# Altium schematic sheet WS485H-V3.SchDoc: WS485H-V1
size A2; Author: Fred; PageSetup: Record=PageOptions|CenterHorizontal=True|CenterVertical=True|PrintScale=1.04|XCorrection=1.00|YCorrection=1.00|PrintKind=0|BorderSize=5000000|LeftOffset=0|BottomOffset=0|Orientation=1|PaperLength=1000|PaperWidth=1000|Scale=100|PaperSource=7|PrintQuality=-4|MediaType=1|DitherType=10|PaperKind=A3|PrintScaleMode=1
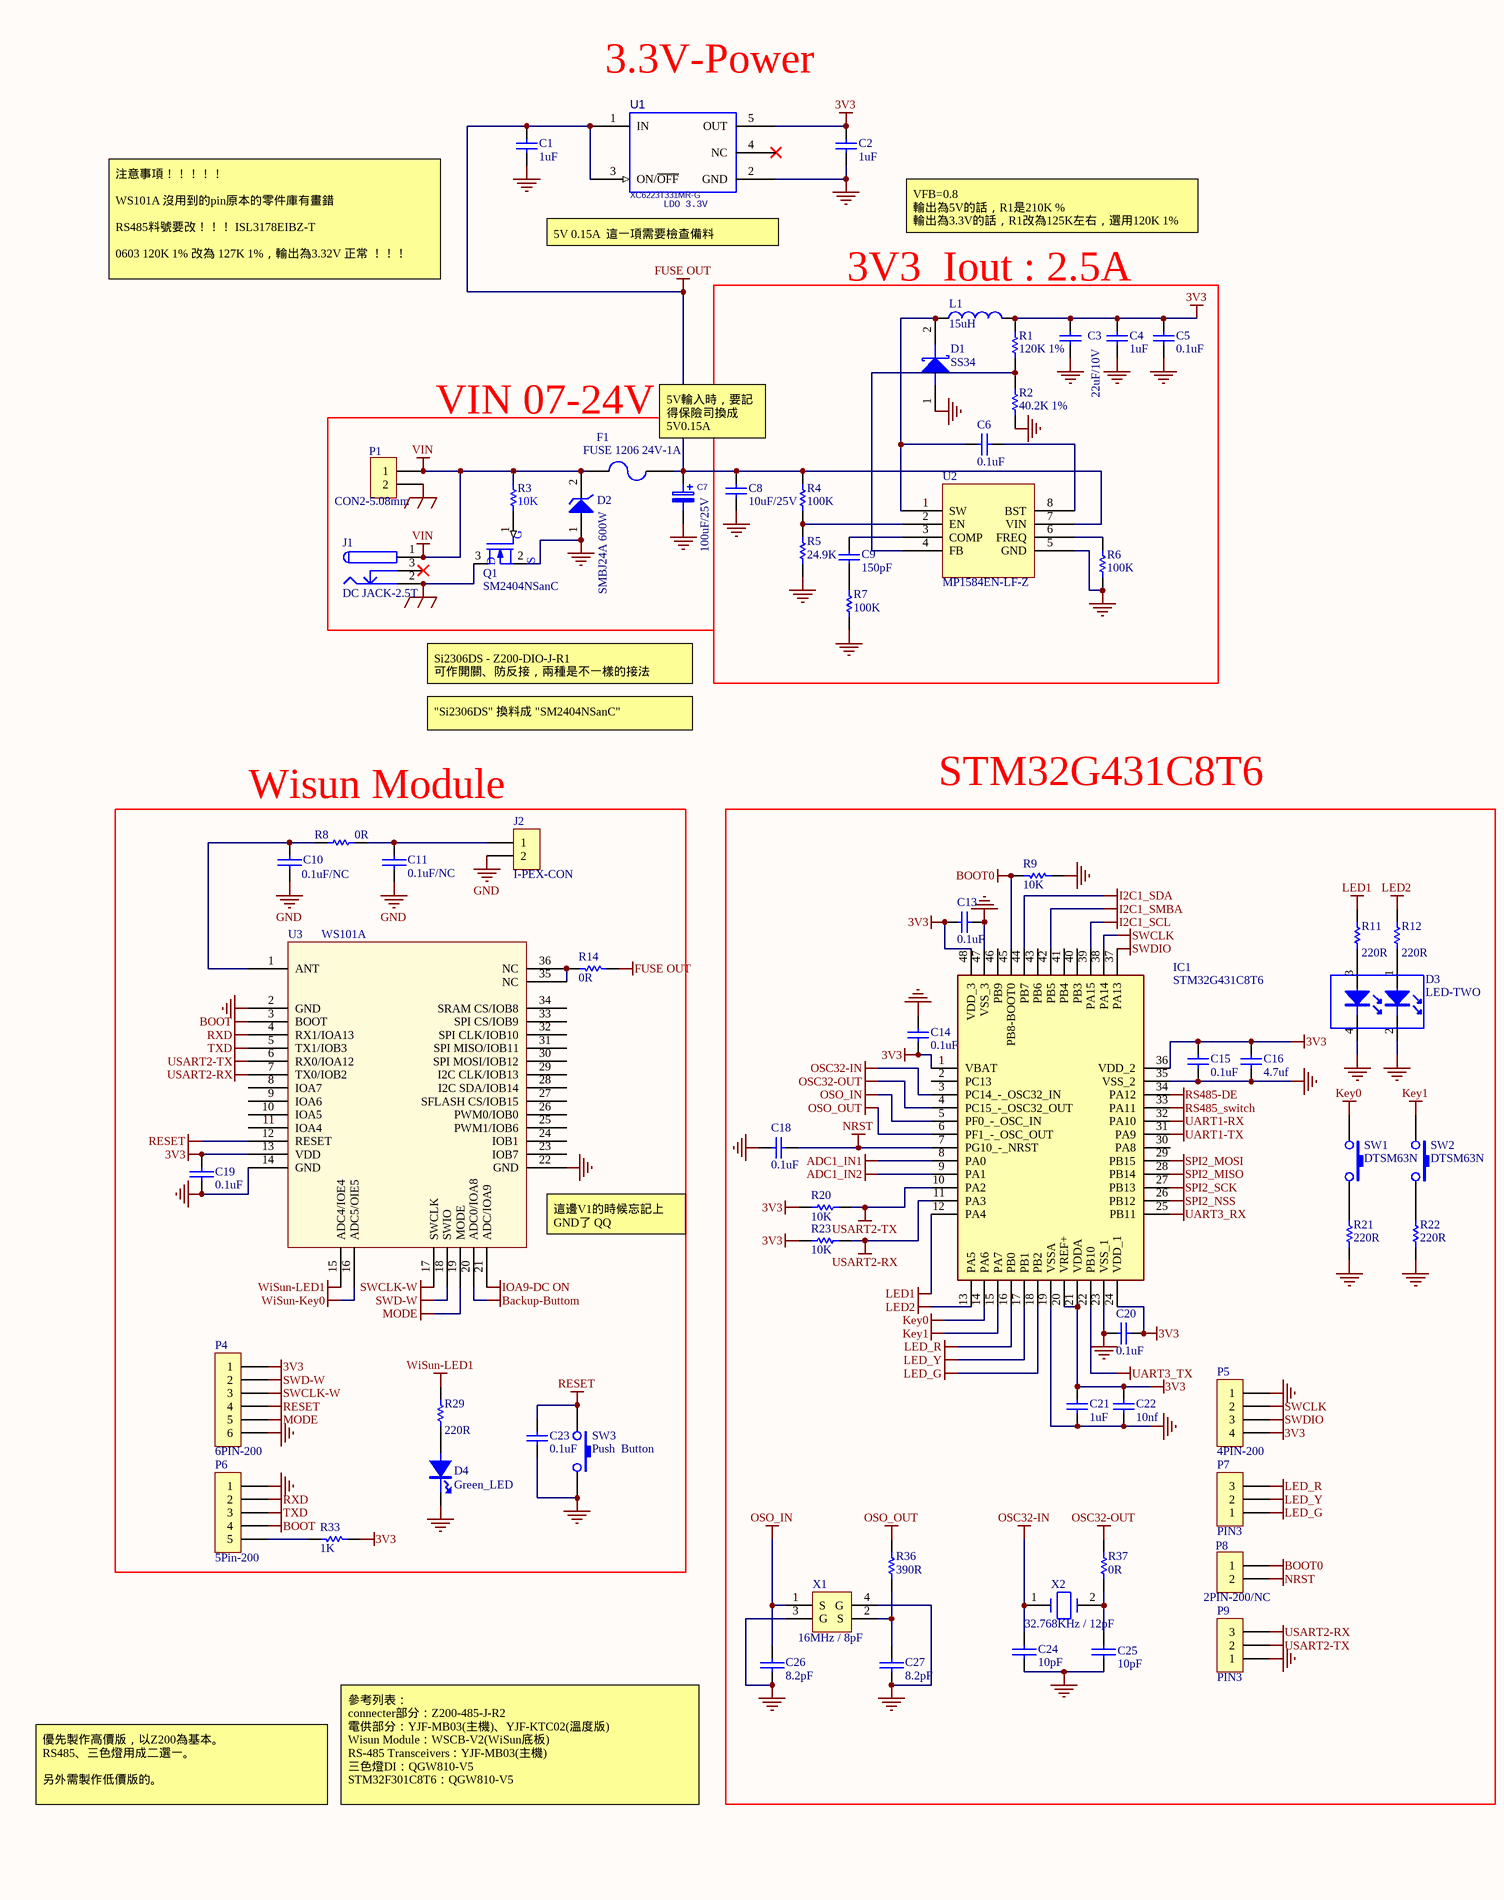
[diagram p0: WS485H-V3.SchDoc, left]
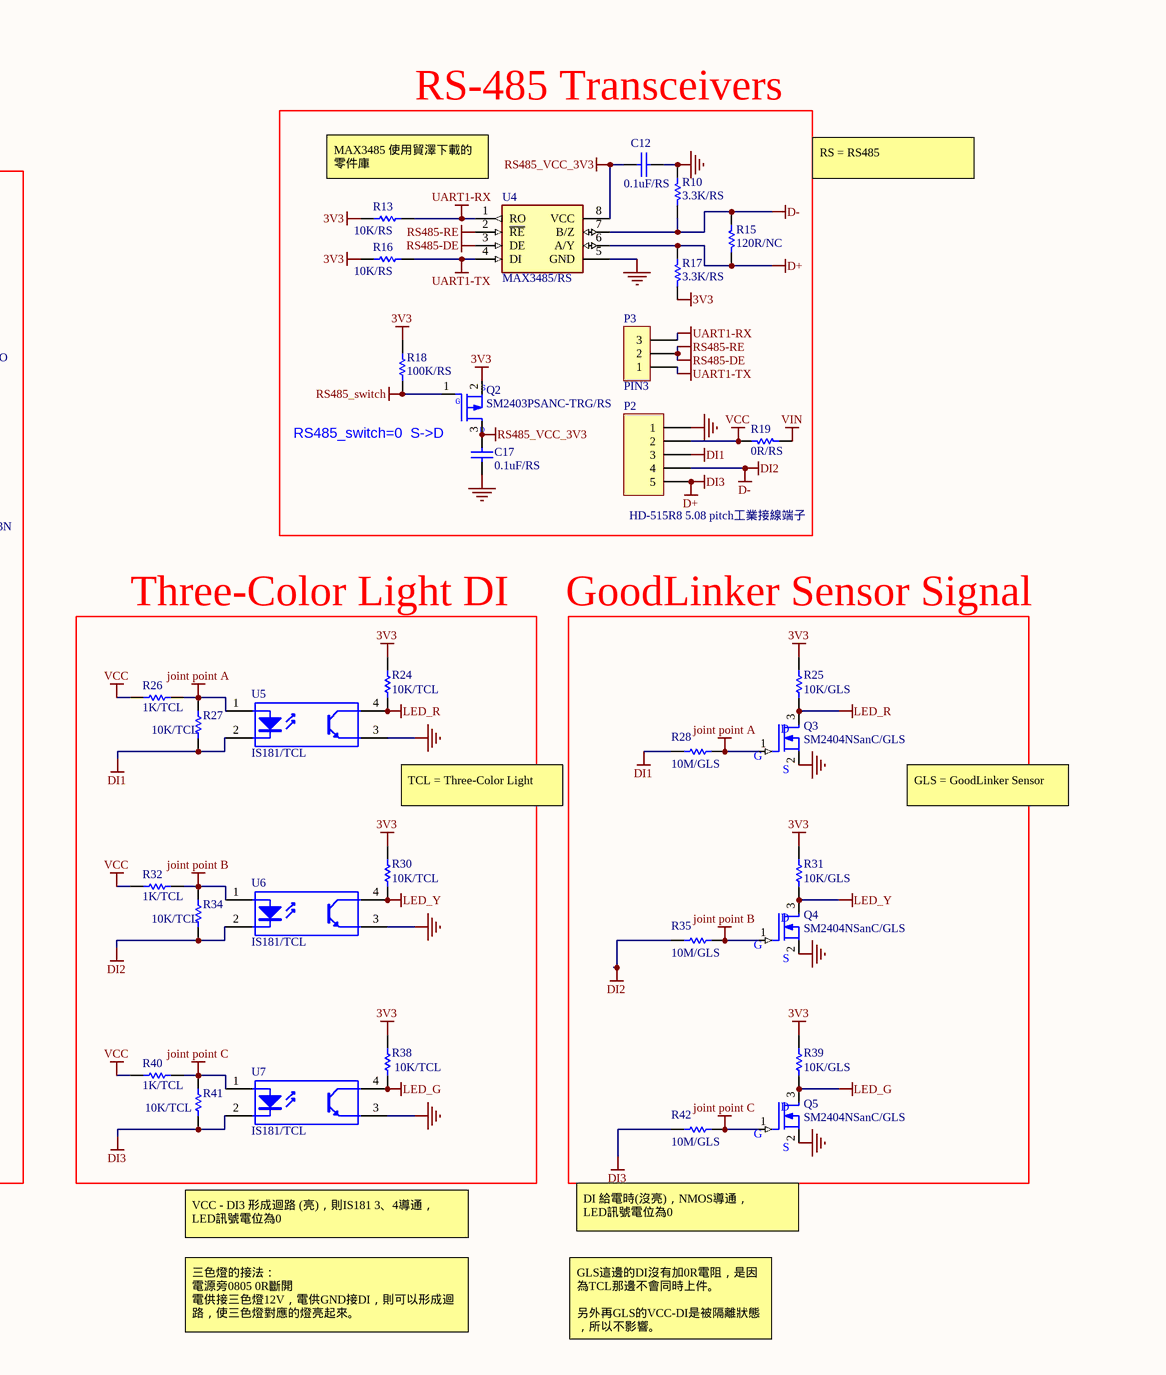
[diagram p1: WS485H-V3.SchDoc, right]

## Parts
C1  1uF  [0603C]
C2  1uF  [0603C]
C3  22uF/10V  [0603C]
C4  1uF  [0603C]
C5  0.1uF  [0603C]
C6  0.1uF  [0603C]
C7  100uF/25V  [DIP CAP-8*3.5]
C8  10uF/25V  [0805C]
C9  150pF  [0603C]
C10  0.1uF/NC  [0402C]
C11  0.1uF/NC  [0402C]
C12  value 0.1uF/RS  [0402C]  (hidden comment: 0.1uF)
C13  0.1uF  [0402C]
C14  0.1uF  [0402C]
C15  0.1uF  [0402C]
C16  4.7uf  [0402C]
C17  value 0.1uF/RS  [0402C]  (hidden comment: 0.1uF)
C18  0.1uF  [0402C]
C19  0.1uF  [0402C]
C20  0.1uF  [0402C]
C21  1uF  [0402C]
C22  10nf  [0402C]
C23  0.1uF  [0402C]
C24  10pF  [0402C]
C25  10pF  [0402C]
C26  8.2pF  [0402C]
C27  8.2pF  [0402C]
D1  SS34  [SMBJ40CA(TVS)]
D2  SMBJ24A 600W  [SMBJ40CA(TVS)]
D3  LED-TWO  [LEDX2HOLD]
D4  Green_LED  [LED0603--0.4mm]
F1  FUSE 1206 24V-1A  [1206-FUSE]
IC1  STM32G431C8T6  [QFP50P900X900X160-48N]
J1  DC JACK-2.5T  [DC JACK-2.5T-NEW]
J2  I-PEX-CON  [I-PEX-CON]
L1  15uH  [L8.3x8.3]
P1  CON2-5.08mm  [OQ5.08-90D-2P]
P2  HD-515R8 5.08 pitch工業接線端子  [OQ5.08-90D-5P]
P3  PIN3  [3PIN-200]
P4  6PIN-200  [6PIN-200]
P5  4PIN-200  [4PIN-200]
P6  5Pin-200  [5pin-200]
P7  PIN3  [3PIN-200]
P8  2PIN-200/NC  [2PIN-200]
P9  PIN3  [3PIN-200]
Q1  SM2404NSanC  [SOT-23]
Q2  value SM2403PSANC-TRG/RS  [SOT-23]  (hidden comment: SM2403PSANC-TRG)
Q3  SM2404NSanC/GLS  [SOT-23]
Q4  SM2404NSanC/GLS  [SOT-23]
Q5  SM2404NSanC/GLS  [SOT-23]
R1  120K 1%  [0603]
R2  40.2K 1%  [0603]
R3  10K  [0603]
R4  100K  [0603]
R5  24.9K  [0603]
R6  100K  [0603]
R7  100K  [0603]
R8  0R  [0402]
R9  10K  [0402]
R10  value 3.3K/RS  [0603]  (hidden comment: 3.3K)
R11  220R  [0603]
R12  220R  [0603]
R13  value 10K/RS  [0402]  (hidden comment: 10K)
R14  0R  [0805]
R15  120R/NC  [0603]
R16  value 10K/RS  [0402]  (hidden comment: 10K)
R17  value 3.3K/RS  [0603]  (hidden comment: 3.3K)
R18  value 100K/RS  [0402]  (hidden comment: 100K)
R19  0R/RS  [0805]
R20  10K  [0402]
R21  220R  [0603]
R22  220R  [0603]
R23  10K  [0402]
R24  value 10K/TCL  [0402]  (hidden comment: 10K)
R25  value 10K/GLS  [0402]  (hidden comment: 10K)
R26  1K/TCL  [0402]
R27  value 10K/TCL  [0402]  (hidden comment: 10K)
R28  value 10M/GLS  [0402]  (hidden comment: 10K)
R29  220R  [0402]
R30  value 10K/TCL  [0402]  (hidden comment: 10K)
R31  value 10K/GLS  [0402]  (hidden comment: 10K)
R32  1K/TCL  [0402]
R33  1K  [0402]
R34  value 10K/TCL  [0402]  (hidden comment: 10K)
R35  value 10M/GLS  [0402]  (hidden comment: 10K)
R36  390R  [0402]
R37  0R  [0402]
R38  value 10K/TCL  [0402]  (hidden comment: 10K)
R39  value 10K/GLS  [0402]  (hidden comment: 10K)
R40  1K/TCL  [0402]
R41  value 10K/TCL  [0402]  (hidden comment: 10K)
R42  value 10M/GLS  [0402]  (hidden comment: 10K)
SW1  DTSM63N  [SW-AT-1102VT1-new]
SW2  DTSM63N  [SW-AT-1102VT1-new]
SW3  Push  Button  [Button_2pin-3*4*2MM]
U1  XC6223T331MR-G  [SOT-23-5-0.95MM]
U2  MP1584EN-LF-Z  [SOIC8E_MP1584EN]
U3  WS101A  [WS101A]
U4  MAX3485/RS  [SOIC127P600X175-8N]
U5  IS181/TCL  [IS181-SMD]
U6  IS181/TCL  [IS181-SMD]
U7  IS181/TCL  [IS181-SMD]
X1  16MHz / 8pF  [XTAL-SMD-20X16]
X2  32.768KHz / 12pF  [XTAL-SMD-32*15]

## Blocks framed on the sheet
3V3  Iout : 2.5A: C3-C6 C8 C9 D1 L1 R1 R2 R4-R7 U2
VIN 07-24V: C7 D2 F1 J1 P1 Q1 R3
RS-485 Transceivers: C12 C17 P2 P3 Q2 R10 R13 R15-R19 U4
Wisun Module: C10 C11 C19 C23 D4 J2 P4 P6 R8 R14 R29 R33 SW3 U3
STM32G431C8T6: C13-C16 C18 C20-C22 C24-C27 D3 IC1 P5 P7-P9 R9 R11 R12 R20-R23 R36 R37 SW1 SW2 X1 X2
Three-Color Light DI: R24 R26 R27 R30 R32 R34 R38 R40 R41 U5-U7

## Nets
3V3: C2.2 C3.2 C4.2 C5.2 C13.2 C14.2 C15.1 C16.1 C19.2 C20.2 C21.1 C22.1 IC1.1(VBAT) IC1.20(VREF+) IC1.21(VDDA) IC1.24(VDD_1) IC1.36(VDD_2) IC1.48(VDD_3) L1.2 P4.1 P5.4 Q2.2(SOURCE) R1.2 R13.2 R16.2 R17.2 R18.2 R20.2 R23.2 R24.2 R25.2 R30.2 R31.2 R33.1 R38.2 R39.2 U1.5(OUT) U3.13(VDD)
ADC1_IN1: IC1.8(PA0)
ADC1_IN2: IC1.9(PA1)
Backup-Buttom: U3.20(ADC0/IOA8)
BOOT: P6.4 U3.3(BOOT)
BOOT0: IC1.45(PB8-BOOT0) P8.1 R9.2
D+: P2.5 R15.2 R17.1 R41.1 R42.2 U4.6(A/Y) U7.2  [also labelled DI3]
D-: P2.4 R10.2 R15.1 R34.1 R35.2 U4.7(B/Z) U6.2  [also labelled DI2]
DI1: P2.3 R27.1 R28.2 U5.2
FUSE OUT: C1.2 C7.1 C8.2 F1.2 R4.2 R14.1 U1.1(IN) U1.3(ON/~{OFF}) U2.7(VIN)
GND: C1.1 C2.1 C3.1 C4.1 C5.1 C7.2 C8.1 C10.1 C11.1 C12.1 C13.1 C14.1 C15.2 C16.2 C17.1 C18.2 C19.1 C20.1 C21.2 C22.2 C23.2 C24.2 C25.2 C26.2 C27.2 D1.1 D2.1 D3.2 D3.4 D4.2 IC1.19(VSSA) IC1.23(VSS_1) IC1.35(VSS_2) IC1.47(VSS_3) J2.2 P2.1 P4.6 P5.1 P6.1 P9.1 Q1.2(SOURCE) Q3.2(SOURCE) Q4.2(SOURCE) Q5.2(SOURCE) R2.1 R5.1 R6.1 R7.1 R9.1 R10.1 R21.2 R22.2 SW1.0(GND) SW2.0(GND) SW3.2 U1.2(GND) U2.0(GND) U2.5(GND) U3.2(GND) U3.14(GND) U3.22(GND) U4.5(GND) U5.3 U6.3 U7.3 X1.3(G) X1.4(G)
I2C1_SCL: IC1.39(PA15)
I2C1_SDA: IC1.44(PB7)
I2C1_SMBA: IC1.42(PB5)
IOA9-DC ON: U3.21(ADC/IOA9)
joint point A: Q3.1(GATE) R26.2 R27.2 R28.1 U5.1
joint point B: Q4.1(GATE) R32.2 R34.2 R35.1 U6.1
joint point C: Q5.1(GATE) R40.2 R41.2 R42.1 U7.1
Key0: IC1.14(PA6) SW1.1
Key1: IC1.15(PA7) SW2.1
LED1: IC1.12(PA4) R11.2
LED2: IC1.13(PA5) R12.2
LED_G: IC1.18(PB2) P7.1 Q5.3(DRAIN) R38.1 R39.1 U7.4
LED_R: IC1.16(PB0) P7.3 Q3.3(DRAIN) R24.1 R25.1 U5.4
LED_Y: IC1.17(PB1) P7.2 Q4.3(DRAIN) R30.1 R31.1 U6.4
MODE: P4.5 U3.19(MODE)
NRST: C18.1 IC1.7(PG10_-_NRST) P8.2
OSC32-IN: C24.1 IC1.3(PC14_-_OSC32_IN) X2.1
OSC32-OUT: IC1.4(PC15_-_OSC32_OUT) R37.1
OSO_IN: C26.1 IC1.5(PF0_-_OSC_IN) X1.1(S)
OSO_OUT: IC1.6(PF1_-_OSC_OUT) R36.1
PGND: J1.2 P1.2 Q1.3(DRAIN)
RESET: C23.1 P4.4 SW3.1 U3.12(RESET)
RS485-DE: IC1.34(PA12) P3.2 U4.2(~{RE}) U4.3(DE)  [also labelled RS485-RE]
RS485_switch: IC1.33(PA11) Q2.1(GATE) R18.1
RS485_VCC_3V3: C12.2 C17.2 Q2.3(DRAIN) U4.8(VCC)
RXD: P6.2 U3.4(RX1/IOA13)
SPI2_MISO: IC1.28(PB14)
SPI2_MOSI: IC1.29(PB15)
SPI2_NSS: IC1.26(PB12)
SPI2_SCK: IC1.27(PB13)
SWCLK: IC1.38(PA14) P5.2
SWCLK-W: P4.3 U3.17(SWCLK)
SWD-W: P4.2 U3.18(SWIO)
SWDIO: IC1.37(PA13) P5.3
TXD: P6.3 U3.5(TX1/IOB3)
UART1-RX: IC1.32(PA10) P3.3 R13.1 U4.1(RO)
UART1-TX: IC1.31(PA9) P3.1 R16.1 U4.4(DI)
UART3_RX: IC1.25(PB11)
UART3_TX: IC1.22(PB10)
USART2-RX: IC1.11(PA3) P9.3 R23.1 U3.7(TX0/IOB2)
USART2-TX: IC1.10(PA2) P9.2 R20.1 U3.6(RX0/IOA12)
VCC: P2.2 R19.2 R26.1 R32.1 R40.1
VIN: D2.2 F1.1 J1.1 P1.1 R3.2 R19.1
WiSun-Key0: U3.16(ADC5/OIE5)
WiSun-LED1: R29.2 U3.15(ADC4/IOE4)
NetC6_1: C6.1 U2.8(BST)
NetC6_2: C6.2 D1.2 L1.1 U2.1(SW)
NetC9_1: C9.1 R7.2
NetC9_2: C9.2 U2.3(COMP)
NetC10_2: C10.2 R8.1 U3.1(ANT)
NetC11_2: C11.2 J2.1 R8.2
NetC25_1: C25.1 R37.2 X2.2
NetC27_1: C27.1 R36.2 X1.2(S)
NetD3_1: D3.1 R12.1
NetD3_3: D3.3 R11.1
NetD4_1: D4.1 R29.1
NetP6_5: P6.5 R33.2
NetQ1_1: Q1.1(GATE) R3.1
NetR1_1: R1.1 R2.2 U2.4(FB)
NetR4_1: R4.1 R5.2 U2.2(EN)
NetR6_2: R6.2 U2.6(FREQ)
NetR14_2: R14.2 U3.35(NC) U3.36(NC)
NetR21_1: R21.1 SW1.2
NetR22_1: R22.1 SW2.2

Not connected (* = marked no-connect by the designer): IC1 2(PC13) 30(PA8) 40(PB3) 41(PB4) 43(PB6) 46(PB9); J1 3*; U1 4(NC)*; U3 8(IOA7) 9(IOA6) 10(IOA5) 11(IOA4) 23(IOB7) 24(IOB1) 25(PWM1/IOB6) 26(PWM0/IOB0) 27(SFLASH_CS/IOB15) 28(I2C_SDA/IOB14) 29(I2C_CLK/IOB13) 30(SPI_MOSI/IOB12) 31(SPI_MISO/IOB11) 32(SPI_CLK/IOB10) 33(SPI_CS/IOB9) 34(SRAM_CS/IOB8)

## Notes on the sheet
- 3.3V-Power
- (near U1) 5V 0.15A  這一項需要檢查備料
- (near U1) LDO 3.3V
- VFB=0.8
  輸出為5V的話，R1是210K %
  輸出為3.3V的話，R1改為125K左右，選用120K 1%
- 注意事項！！！！！
  WS101A 沒用到的pin原本的零件庫有畫錯
  RS485料號要改！！！ ISL3178EIBZ-T
  0603 120K 1% 改為 127K 1%，輸出為3.32V 正常 ！！！
- 5V輸入時，要記得保險司換成5V0.15A
- Si2306DS - Z200-DIO-J-R1
  可作開關、防反接，兩種是不一樣的接法
- "Si2306DS" 換料成 "SM2404NSanC"
- C1 旁在加10uf  1uf 兩個 1uf
  電容10uf以上的用0603，因為0402的貴
- MAX3485 使用貿澤下載的零件庫
- RS = RS485
- (near Q2) RS485_switch=0  S->D
- (near U3) 這邊V1的時候忘記上GND了 QQ
- GoodLinker Sensor Signal
- TCL = Three-Color Light
- GLS = GoodLinker Sensor
- 註解快捷鍵：P+E+O
- 問題：
  ．12V保險絲為何用1A & 為何要保險絲
  ．關於RS485，D+D-中間為何要有個NC電阻
- 優先製作高價版，以Z200為基本。
  RS485、三色燈用成二選一。
  另外需製作低價版的。
- 參考列表：
  connecter部分：Z200-485-J-R2
  電供部分：YJF-MB03(主機)、YJF-KTC02(溫度版)
  Wisun Module：WSCB-V2(WiSun底板)
  RS-485 Transceivers：YJF-MB03(主機)
  三色燈DI：QGW810-V5
  STM32F301C8T6：QGW810-V5
- DI 給電時(沒亮)，NMOS導通，
  LED訊號電位為0
- VCC - DI3 形成迴路 (亮)，則IS181 3、4導通，
  LED訊號電位為0
- 三色燈的接法：
  電源旁0805 0R斷開
  電供接三色燈12V，電供GND接DI，則可以形成迴路，使三色燈對應的燈亮起來。
- GLS這邊的DI沒有加0R電阻，是因為TCL那邊不會同時上件。
  另外再GLS的VCC-DI是被隔離狀態，所以不影響。
- (in symbol MOSFET N-1) G; D; S
- (in symbol MOSFET P-1) S; G; D

## Library data of the parts
C1-C6 C8 C9 C13-C18 C20-C23 = Cap Semi: Capacitor (Semiconductor SIM Model); Published: 8-Jun-2000; LatestRevisionDate: 17-Jul-2002; LatestRevisionNote: Re-released for DXP Platform.; PackageReference: C1206; Publisher: Altium Limited
  C1 C2 C4 C21: Value: 1uF
  C3: Value: 22uF/10V
  C5 C6 C13-C15 C18 C20 C23: Value: 0.1uF
  C8: Value: 10uF/25V
  C9: Value: 150pF
  C16: Value: 4.7uf
  C22: Value: 10nf
C7 = C POL: Part Number: 53300833000; Right: 20; Tolerance: 20%; Rating: 10V; Package Height: 1.8mm; PCB_x: 19.129500; PCB_y: 12.184000; PCB_dir: 0.000000; PCB_loc: Top; Bottom: 20; Value: 100uF/25V
C10-C12 C19 C24-C27 = CAP: Capacitor
  C19: Value: 0.1uF
D1 = DIODE SCHOTTKY: Schottky Diode
D2 = PESD5V0L1BA: Zener Diode
D4 = LED: Manufacturer's Part Number: CL-170G-CD-T; Part Number: 41100017000; Manufacturer: Citizen; Old Part Number: 4317000; Right: 40; Bottom: 20; VALUE_ALLEGRO: Red_LED; Package Height: 1.1mm; FPLIST: mot/0805LED,dig/0805led; PCB_x: 46.095000; PCB_y: 6.420000; PCB_dir: 90.000000; Cost: 0.48
F1 = FUSE2: Fuse
IC1 = STM32G431C8T6: Integrated Circuit; Manufacturer_Name: STMicroelectronics; Datasheet Link: https://www.arrow.com/en/products/stm32g431c8t6/stmicroelectronics; Height: 1.6mm; Manufacturer_Part_Number: STM32G431C8T6
J1 = DCJACK-1: Low Voltage Power Supply Connector; Published: *; DatasheetDocument: *; Publisher: *; ComponentLink1Description: *; ComponentLink1URL: *
J2 P1 P8 = CON2: Connector
L1 = Inductor: Code_IEC: 1005; Published: 8-Jun-2000; LatestRevisionDate: 17-Jul-2002; LatestRevisionNote: Re-released for DXP Platform.; PackageReference: 0402-A; Publisher: Altium Limited; Code_JEITA: 0402; Value: 15uH
P2 = Header 5: Header, 5-Pin; LatestRevisionDate: 17-Jul-2002; LatestRevisionNote: Re-released for DXP Platform.; Publisher: Altium Limited
P3 P7 P9 = PIN3: Connector
P4 = 6PIN-200: Pin Header; LatestRevisionDate: 17-Jul-2002; LatestRevisionNote: Re-released for DXP Platform.; Publisher: Altium Limited
P5 = CON4: Connector; Value: MicroUSB
P6 = PIN5
Q1 Q3-Q5 = MOSFET N-1: N-Channel Mosfet; Value: 2SK3664
Q2 = MOSFET P-1: P MOSFET
R1 R2 R4-R13 R15-R18 R20-R25 R27-R31 R33-R39 R41 R42 = Res Semi: Semiconductor Resistor
  R1: Published: 8-Jun-2000; LatestRevisionDate: 17-Jul-2002; LatestRevisionNote: Re-released for DXP Platform.; PackageReference: AXIAL-0.5; Publisher: Altium Limited; Value: 120K 1%
  R2: Published: 8-Jun-2000; LatestRevisionDate: 17-Jul-2002; LatestRevisionNote: Re-released for DXP Platform.; PackageReference: AXIAL-0.5; Publisher: Altium Limited; Value: 40.2K 1%
  R4 R6 R7: Published: 8-Jun-2000; LatestRevisionDate: 17-Jul-2002; LatestRevisionNote: Re-released for DXP Platform.; PackageReference: AXIAL-0.5; Publisher: Altium Limited; Value: 100K
  R5: Published: 8-Jun-2000; LatestRevisionDate: 17-Jul-2002; LatestRevisionNote: Re-released for DXP Platform.; PackageReference: AXIAL-0.5; Publisher: Altium Limited; Value: 24.9K
  R8 R37: Published: 8-Jun-2000; LatestRevisionDate: 17-Jul-2002; LatestRevisionNote: Re-released for DXP Platform.; PackageReference: AXIAL-0.5; Publisher: Altium Limited; Value: 0R
  R9 R20 R23: Published: 8-Jun-2000; LatestRevisionDate: 17-Jul-2002; LatestRevisionNote: Re-released for DXP Platform.; PackageReference: AXIAL-0.5; Publisher: Altium Limited; Value: 10K
  R10 R13 R16 R17 R24 R25 R27 R28 R30 R31 R34 R35 R38 R39 R41 R42: Published: 8-Jun-2000; LatestRevisionDate: 17-Jul-2002; LatestRevisionNote: Re-released for DXP Platform.; PackageReference: AXIAL-0.5; Publisher: Altium Limited
  R11 R12 R21 R22 R29: Published: 8-Jun-2000; LatestRevisionDate: 17-Jul-2002; LatestRevisionNote: Re-released for DXP Platform.; PackageReference: AXIAL-0.5; Publisher: Altium Limited; Value: 220R
  R15: Published: 8-Jun-2000; LatestRevisionDate: 17-Jul-2002; LatestRevisionNote: Re-released for DXP Platform.; PackageReference: AXIAL-0.5; Publisher: Altium Limited; Value: 120R/NC
  R33: Published: 8-Jun-2000; LatestRevisionDate: 17-Jul-2002; LatestRevisionNote: Re-released for DXP Platform.; PackageReference: AXIAL-0.5; Publisher: Altium Limited; Value: 1K
  R36: Published: 8-Jun-2000; LatestRevisionDate: 17-Jul-2002; LatestRevisionNote: Re-released for DXP Platform.; PackageReference: AXIAL-0.5; Publisher: Altium Limited; Value: 390R
R3 R26 R32 R40 = Res Semi: Semiconductor Resistor; Value: 1K; Published: 8-Jun-2000; LatestRevisionDate: 17-Jul-2002; LatestRevisionNote: Re-released for DXP Platform.; PackageReference: AXIAL-0.5; Publisher: Altium Limited
R14 R19 = Res Semi: Semiconductor Resistor; Value: 0R/NC; Published: 8-Jun-2000; LatestRevisionDate: 17-Jul-2002; LatestRevisionNote: Re-released for DXP Platform.; PackageReference: AXIAL-0.5; Publisher: Altium Limited
SW1 SW2 = SW1
SW3 = SW1: Push Button; Value: Switch-SMD-6x6mm
U4 = ISL3178EIBZ-T: Integrated Circuit; Manufacturer_Name: Renesas Electronics; Datasheet Link: https://www.renesas.com/en-us/www/doc/datasheet/isl3170e-71e-72e-73e-74e-75e-76e-77e-78e.pdf; Height: 1.75mm; Manufacturer_Part_Number: ISL3178EIBZ-T
U5-U7 = Optoisolator1: 4-Pin Phototransistor Optocoupler; Published: 24-Mar-1999; LatestRevisionDate: 04-Mar-2005; LatestRevisionNote: Sch pins 3 & 4 Swapped.; DatasheetDocument: Nov-2003; PackageReference: DIP-4; Publisher: Altium Limited
X1 = XTAL-SMD-25*32
X2 = XTAL: Text Field1: 20; Text Field2: 20